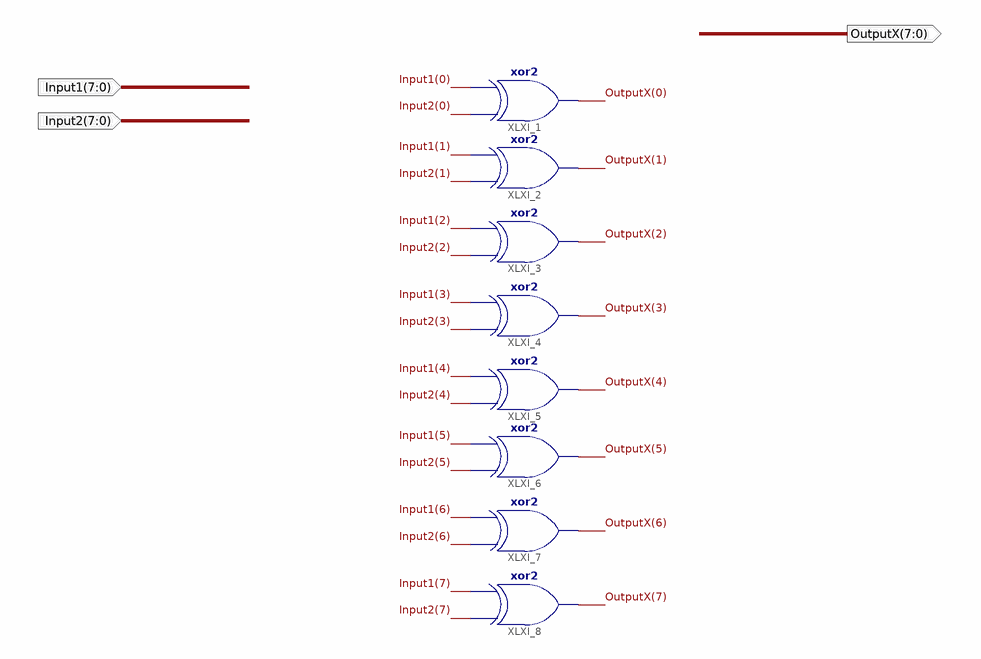
[diagram p0: schematic sheet 1]
// Xilinx ISE schematic Xor8Bit.sch (spartan6) as structural Verilog: 8 symbols, 3 ports
module Xor8Bit (
  input  [7:0] Input1,
  input  [7:0] Input2,
  output [7:0] OutputX
);

  xor XLXI_1 (OutputX[0], Input2[0], Input1[0]);
  xor XLXI_2 (OutputX[1], Input2[1], Input1[1]);
  xor XLXI_3 (OutputX[2], Input2[2], Input1[2]);
  xor XLXI_4 (OutputX[3], Input2[3], Input1[3]);
  xor XLXI_5 (OutputX[4], Input2[4], Input1[4]);
  xor XLXI_6 (OutputX[5], Input2[5], Input1[5]);
  xor XLXI_7 (OutputX[6], Input2[6], Input1[6]);
  xor XLXI_8 (OutputX[7], Input2[7], Input1[7]);
endmodule
